# EasyEDA schematic SCH_Term_Digital_2025-01-27.json
TITLE: Termometro digital; REV: 1.0; Date: 2025-01-27; Sheet: 1/1; Company: Your Company
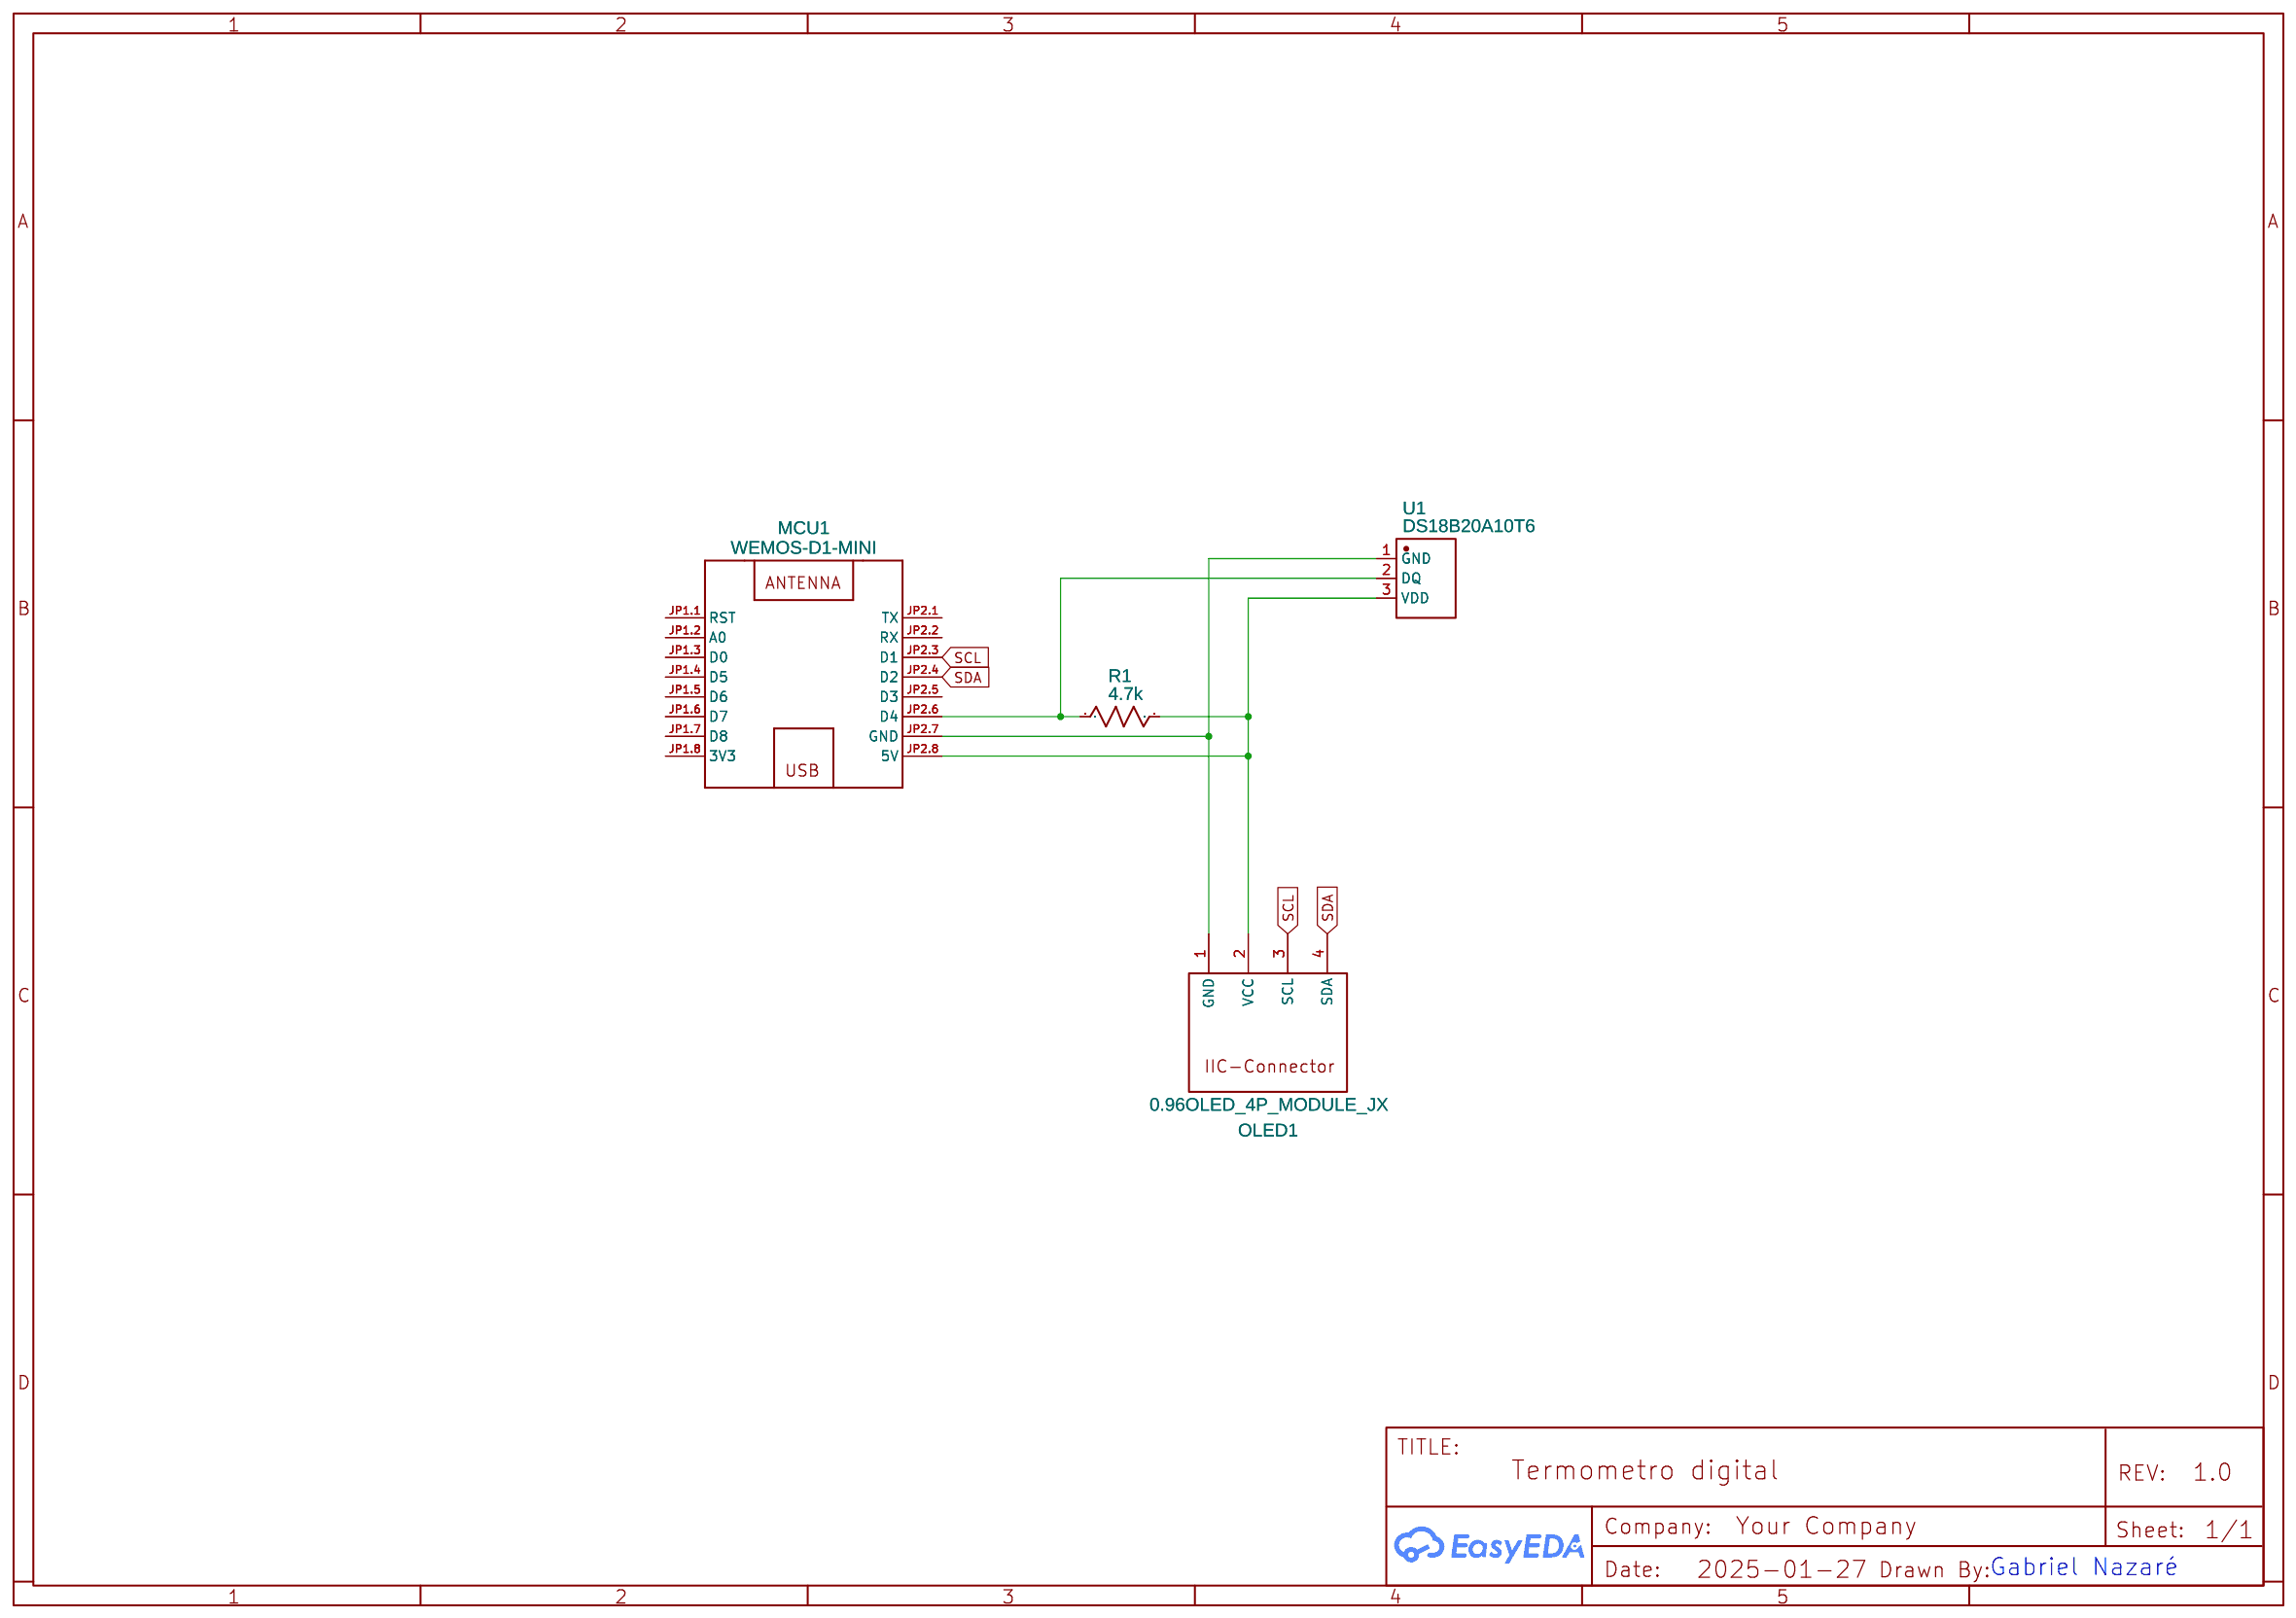
[diagram p0: schematic sheet]

## Parts
MCU1  WEMOS-D1-MINI  [WEMOS-D1-MINI]
OLED1  0.96OLED_4P_MODULE_JX  [0.96OLED_4P]
R1  4.7k  [R0603]
U1  DS18B20A10T6  [TO-92-SMD_L4.6-W4.6-P1.27_DS18B20]

## Library data of the parts
MCU1 = WEMOS-D1-MINI: Contributor: Baylin Bridges
OLED1 = 0.96OLED_4P_MODULE_JX: Contributor: LCSC; Supplier: LCSC; Supplier Part: C9900004566; Manufacturer: null; JLCPCB Part Class: Extended Part
R1 = R_0603_US: Contributor: LCEDA_Lib
U1 = DS18B20A10T6: Supplier: LCSC; Supplier Part: C22360667; Manufacturer: Mysentech(敏源传感); Contributor: lcsc; JLCPCB Part Class: Extended Part

## Nets
SCL: MCU1.JP2.3(D1) OLED1.3(SCL)
SDA: MCU1.JP2.4(D2) OLED1.4(SDA)
Net-(MCU1-JP2.6): MCU1.JP2.6(D4) R1.1 U1.2(DQ)
Net-(MCU1-JP2.7): MCU1.JP2.7(GND) OLED1.1(GND) U1.1(GND)
Net-(MCU1-JP2.8): MCU1.JP2.8(5V) OLED1.2(VCC) R1.2 U1.3(VDD)

Not connected (* = marked no-connect by the designer): MCU1 JP1.1(RST) JP1.2(A0) JP1.3(D0) JP1.4(D5) JP1.5(D6) JP1.6(D7) JP1.7(D8) JP1.8(3V3) JP2.1(TX) JP2.2(RX) JP2.5(D3)

## Notes on the sheet
- Gabriel Nazaré
